# Altium schematic sheet Sheet1.SchDoc
size A
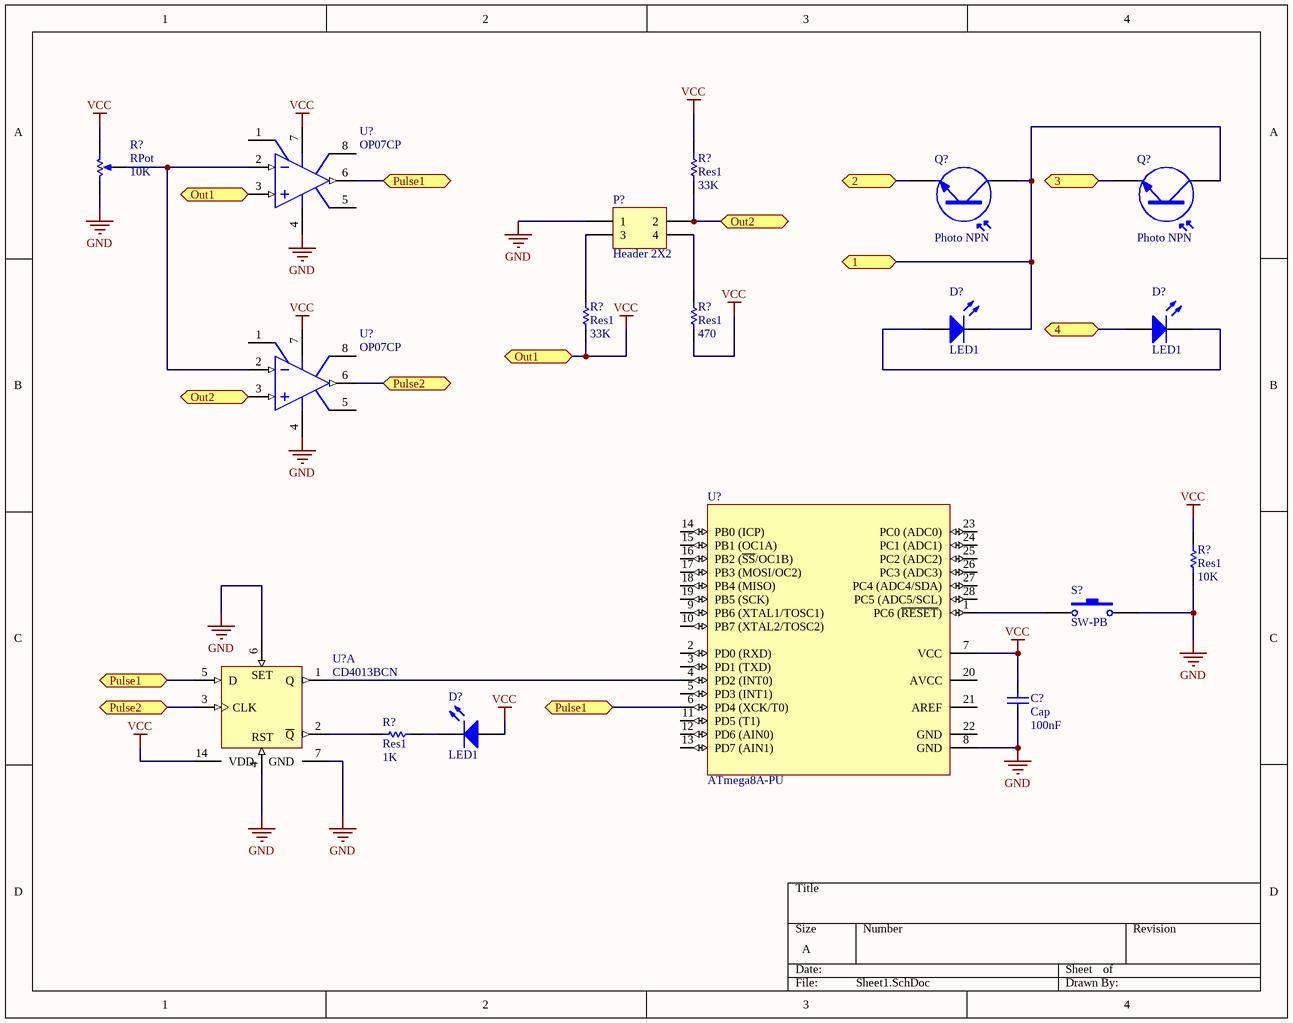
[diagram p0: Sheet1.SchDoc]

## Parts
(Parts that share a designator on the sheet are numbered #1, #2 ... from top to bottom, then left to right.)
C?  Cap  value 100nF  [RAD-0.3]
D?#1  LED1  [LED-1]
D?#2  LED1  [LED-1]
D?#3  LED1  [LED-1]
P?  Header 2X2  [HDR2X2]
Q?#1  Photo NPN  [TO-220_A]
Q?#2  Photo NPN  [TO-220_A]
R?#1  RPot  value 10K  [VR5]
R?#2  Res1  value 33K  [AXIAL-0.3]
R?#3  Res1  value 33K  [AXIAL-0.3]
R?#4  Res1  value 470  [AXIAL-0.3]
R?#5  Res1  value 10K  [AXIAL-0.3]
R?#6  Res1  value 1K  [AXIAL-0.3]
S?  SW-PB  [SPST-2]
U?#1  OP07CP  [N-8_A]
U?#2  OP07CP  [N-8_A]
U?#3  ATmega8A-PU  [28P3]
U?#4  CD4013BCN  [N14A]  (part A of 2)

## Ports
1, 2, 3, 4, Out1, Out2, Pulse1, Pulse2

## Nets
GND: C?.1 P?.1 R?#1.2(BOT) R?#5.1 S?.2 U?#1.4(V-) U?#2.4(V-) U?#3.8(GND) U?#4.4(RST) U?#4.6(S) U?#4.7(GND)
VCC: C?.2 D?#3.1(A) R?#1.1(TOP) R?#2.2 R?#3.1 R?#4.1 R?#5.2 U?#1.3(IN+) U?#1.7(V+) U?#2.7(V+) U?#3.7(VCC) U?#4.14(VDD) ; port Out1
1: D?#1.2(K) Q?#1.1(C) Q?#2.1(C) ; port 1
2: Q?#1.3(E) ; port 2
3: Q?#2.3(E) ; port 3
4: D?#2.1(A) ; port 4
Out2: P?.2 R?#2.1 U?#2.3(IN+) ; port Out2
Pulse1: U?#1.6(OUT) U?#3.6(PD4_(XCK/T0)) U?#4.5(D) ; port Pulse1
Pulse2: U?#2.6(OUT) U?#4.3(CLK) ; port Pulse2
NetD?#1_1: D?#1.1(A) D?#2.2(K)
NetD?#3_2: D?#3.2(K) R?#6.2
NetP?_3: P?.3 R?#3.2
NetP?_4: P?.4 R?#4.2
NetR?#1_3: R?#1.3(TAP) U?#1.2(IN-) U?#2.2(IN-)
NetR?#6_1: R?#6.1 U?#4.2(~{Q})
NetS?_1: S?.1 U?#3.1(PC6_(~{RESET}))
NetU?#3_4: U?#3.4(PD2_(INT0)) U?#4.1(Q)

Not connected (* = marked no-connect by the designer): U?#1 1(VOSTRIM) 5(NC) 8(VOSTRIM); U?#2 1(VOSTRIM) 5(NC) 8(VOSTRIM); U?#3 2(PD0_(RXD)) 3(PD1_(TXD)) 5(PD3_(INT1)) 9(PB6_(XTAL1/TOSC1)) 10(PB7_(XTAL2/TOSC2)) 11(PD5_(T1)) 12(PD6_(AIN0)) 13(PD7_(AIN1)) 14(PB0_(ICP)) 15(PB1_(OC1A)) 16(PB2_(~{SS}/OC1B)) 17(PB3_(MOSI/OC2)) 18(PB4_(MISO)) 19(PB5_(SCK)) 20(AVCC) 21(AREF) 22(GND) 23(PC0_(ADC0)) 24(PC1_(ADC1)) 25(PC2_(ADC2)) 26(PC3_(ADC3)) 27(PC4_(ADC4/SDA)) 28(PC5_(ADC5/SCL))

## Notes on the sheet
- (in symbol CD4013BCN, part A) SET

## Library data of the parts
C? = Cap: Capacitor; Published: 8-Jun-2000; LatestRevisionDate: 17-Jul-2002; LatestRevisionNote: Re-released for DXP Platform.; PackageReference: RAD-0.3; Publisher: Altium Limited
D?#1-D?#3 = LED1: Typical RED GaAs LED; Published: 8-Jun-2000; LatestRevisionDate: 08-Jul-2005; LatestRevisionNote: Mech Layer 1 removed.; PackageReference: LED-1; Publisher: Altium Limited
P? = Header 2X2: Header, 2-Pin, Dual row; LatestRevisionDate: 17-Jul-2002; LatestRevisionNote: Re-released for DXP Platform.; Publisher: Altium Limited
Q?#1 Q?#2 = Photo NPN: NPN Phototransistor; Published: 24-Mar-1999; LatestRevisionDate: 17-Jul-2002; LatestRevisionNote: Re-released for DXP Platform.; PackageReference: TO-220_A; Publisher: Altium Limited; Code_JEDEC: TO-220-AC
R?#1 = RPot: Potentiometer; Sim Note: Enter the Resistance value and the set point into parameter fields.; Set Position: 0.5; Published: 8-Jun-2000; LatestRevisionDate: 17-Jul-2002; LatestRevisionNote: Re-released for DXP Platform.; PackageReference: VR5; Publisher: Altium Limited
R?#2-R?#6 = Res1: Resistor; Published: 8-Jun-2000; LatestRevisionDate: 17-Jul-2002; LatestRevisionNote: Re-released for DXP Platform.; PackageReference: AXIAL-0.3; Publisher: Altium Limited
S? = SW-PB: Switch; Published: 24-Mar-1999; LatestRevisionDate: 17-Jul-2002; LatestRevisionNote: Re-released for DXP Platform.; PackageReference: SPST-2; Publisher: Altium Limited
U?#1 U?#2 = OP07CP: Ultra-Low Offset Voltage Operational Amplifier; Note: Pin 5 is not connected.; Published: 8-Jun-2000; LatestRevisionDate: 04-Mar-2005; LatestRevisionNote: Stylized 3D Model Added.; DatasheetVersion: 1992; PackageReference: N-8_A; Publisher: Altium Limited; PackageDescription: DIP; 8 Leads; Row Spacing 7.62 mm; Pitch 2.54 mm; Code_JEDEC: MO-001-AN; ComponentLink1Description: Manufacturer Link; ComponentLink1URL: http://www.analog.com/en/prod/0,,759_786_OP07%2C00.html; ComponentLink2Description: Datasheet; ComponentLink2URL: http://www.analog.com/UploadedFiles/Data_Sheets/39161232478959OP07_c.pdf
U?#3 = ATmega8A-PU: 8-bit AVR Microcontroller, 8KB Flash, 512 Bytes EEPROM, 1KB SRAM, 28-pin PDIP, Industrial Grade (-40°C to 85°C); Published: 1-Apr-2010; DatasheetVersion: revC, Jul-2009; PackageVersion: revB, Sep-2001; PackageReference: 28P3; Publisher: Altium Limited; PackageDescription: 28-lead (0.300"/7.62mm Wide) Plastic Dual Inline Package (PDIP); Supplier 1: Digi-Key; Supplier Part Number 1: ATMEGA8A-PU-ND; Supplier 2: Farnell; Supplier Part Number 2: 1748534; Supplier 3: Mouser; Supplier Part Number 3: 556-ATMEGA8A-PU; ComponentLink1Description: Manufacturer Link; ComponentLink1URL: http://www.atmel.com/products/avr/default.asp?; ComponentLink2Description: ATmega8A Datasheet; ComponentLink2URL: http://www.atmel.com/dyn/resources/prod_documents/doc8159.pdf; ComponentLink3Description: ATmega8A Summary; ComponentLink3URL: http://www.atmel.com/dyn/resources/prod_documents/8159S.pdf; ComponentLink4Description: Atmel.com Home; ComponentLink4URL: http://www.atmel.com
U?#4 = CD4013BCN: Dual D-Type Flip-Flop; Published: 17-Jul-2002; LatestRevisionDate: 29-May-2009; LatestRevisionNote: Component Body Added.; DatasheetVersion: Jan-1999; PackageVersion: 2000; PackageReference: N14A; Publisher: Altium Limited; PackageDescription: DIP, 14-Pin, Row Spacing 7.62 mm, Pitch 2.54 mm; ComponentLink1Description: Manufacturer Link; ComponentLink1URL: http://www.fairchildsemi.com/